# Altium schematic sheet [3] Motor Drives.SchDoc
size A4
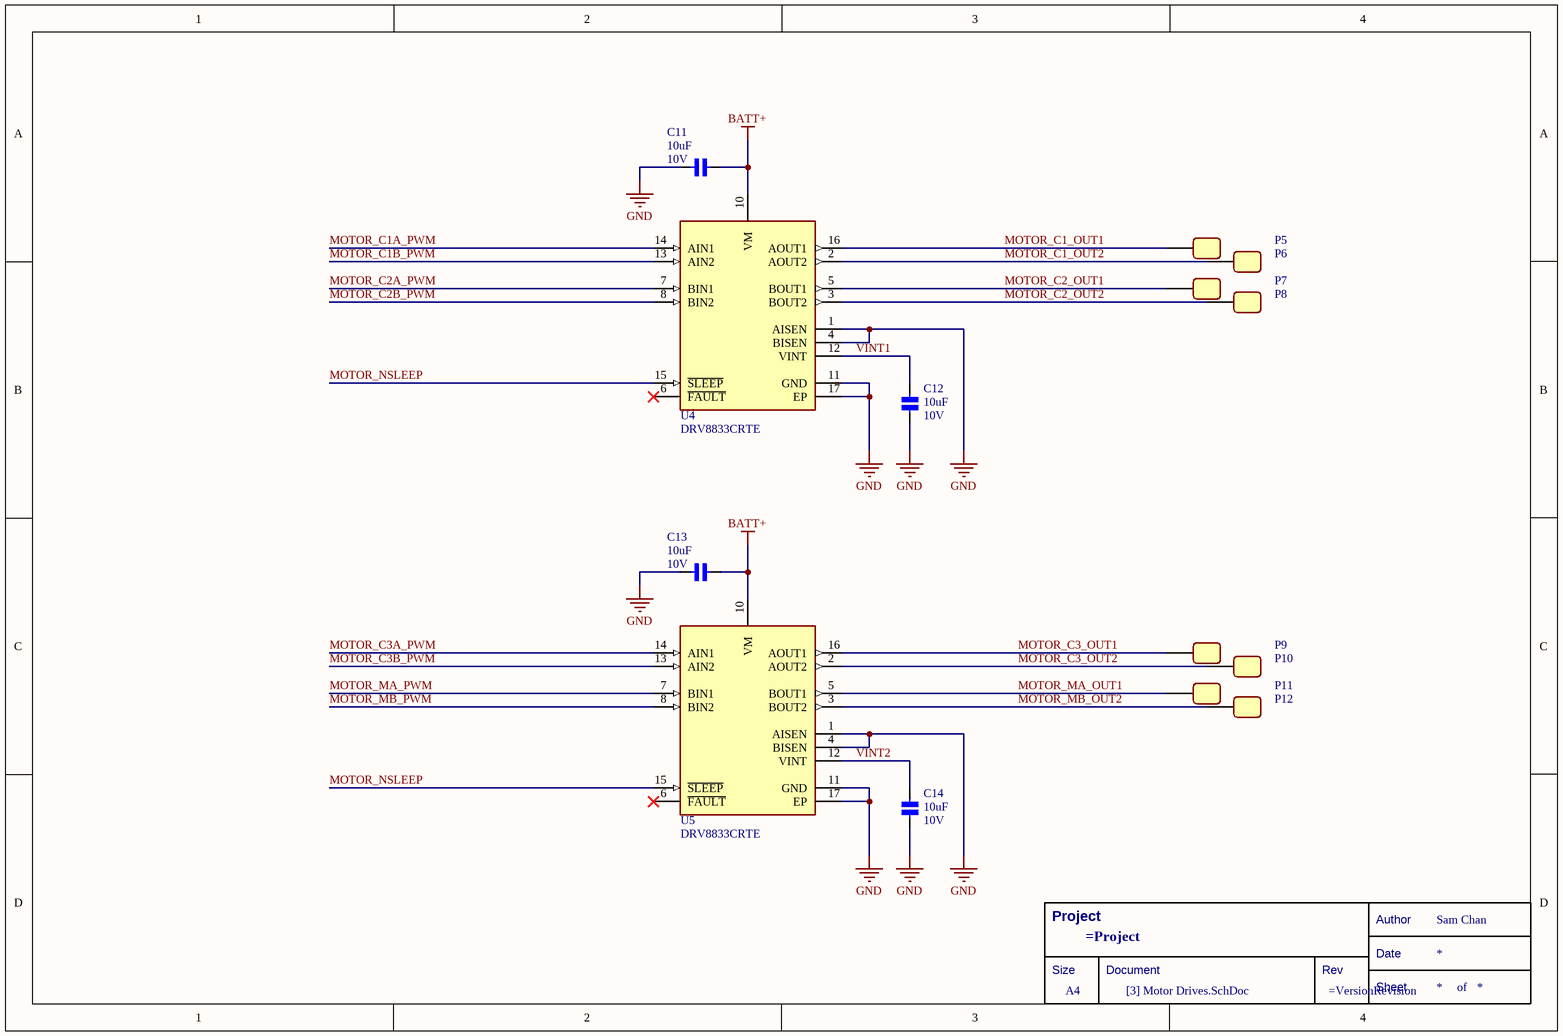
[diagram p0: [3] Motor Drives.SchDoc]

## Parts
*  Title Block  (value not drawn)  (graphical)
C11  Voltage - Rated: 10V  [CAPC0402X05N]  (hidden comment: 10uF)
C12  Voltage - Rated: 10V  [CAPC0402X05N]  (hidden comment: 10uF)
C13  Voltage - Rated: 10V  [CAPC0402X05N]  (hidden comment: 10uF)
C14  Voltage - Rated: 10V  [CAPC0402X05N]  (hidden comment: 10uF)
P5  PAD_1  [PAD_1.0X1.5MM]  (value not drawn)  (no BOM)
P6  PAD_1  [PAD_1.0X1.5MM]  (value not drawn)  (no BOM)
P7  PAD_1  [PAD_1.0X1.5MM]  (value not drawn)  (no BOM)
P8  PAD_1  [PAD_1.0X1.5MM]  (value not drawn)  (no BOM)
P9  PAD_1  [PAD_1.0X1.5MM]  (value not drawn)  (no BOM)
P10  PAD_1  [PAD_1.0X1.5MM]  (value not drawn)  (no BOM)
P11  PAD_1  [PAD_1.0X1.5MM]  (value not drawn)  (no BOM)
P12  PAD_1  [PAD_1.0X1.5MM]  (value not drawn)  (no BOM)
U4  DRV8833CRTE  [DRV8833CRTER]
U5  DRV8833CRTE  [DRV8833CRTER]

## Nets
BATT+: C11.2 C13.2 U4.10(VM) U5.10(VM)
GND: C11.1 C12.2 C13.1 C14.2 U4.1(AISEN) U4.4(BISEN) U4.11(GND) U4.17(EP) U5.1(AISEN) U5.4(BISEN) U5.11(GND) U5.17(EP)
MOTOR_C1_OUT1: P5.1 U4.16(AOUT1)
MOTOR_C1_OUT2: P6.1 U4.2(AOUT2)
MOTOR_C1A_PWM: U4.14(AIN1)
MOTOR_C1B_PWM: U4.13(AIN2)
MOTOR_C2_OUT1: P7.1 U4.5(BOUT1)
MOTOR_C2_OUT2: P8.1 U4.3(BOUT2)
MOTOR_C2A_PWM: U4.7(BIN1)
MOTOR_C2B_PWM: U4.8(BIN2)
MOTOR_C3_OUT1: P9.1 U5.16(AOUT1)
MOTOR_C3_OUT2: P10.1 U5.2(AOUT2)
MOTOR_C3A_PWM: U5.14(AIN1)
MOTOR_C3B_PWM: U5.13(AIN2)
MOTOR_MA_OUT1: P11.1 U5.5(BOUT1)
MOTOR_MA_PWM: U5.7(BIN1)
MOTOR_MB_OUT2: P12.1 U5.3(BOUT2)
MOTOR_MB_PWM: U5.8(BIN2)
MOTOR_NSLEEP: U4.15(~{SLEEP}) U5.15(~{SLEEP})
VINT1: C12.1 U4.12(VINT)
VINT2: C14.1 U5.12(VINT)

Not connected (* = marked no-connect by the designer): U4 6(~{FAULT})*; U5 6(~{FAULT})*

## Notes on the sheet
- (in symbol Title Block) Project; Author; Sam Chan; Date; Size; Document; Rev; A4; Sheet; of

## Library data of the parts
* = Title Block: Standard Title Block
C11-C14 = CER 10UF 10V: CAP CER 10UF 10V X5R 0402; Manufacturer: Murata Electronics; Manufacturer Part Number: GRM155R61A106ME44D; Category: Capacitors; Supplier 1: LCSC; Supplier Part Number 1: C77000; Package / Case: 0402; Capacitance: 10uF
P5-P12 = PAD_1: a Rec Pad, 1.0X1.5mm
U4 U5 = DRV8833CRTE: Bipolar Motor Driver Power MOSFET PWM 16-WQFN (3x3); Manufacturer: Texas Instruments; Categories: Motor Drivers, Controllers; Case: 16-WQFN Exposed Pad; Manufacturer Part Number: DRV8833CRTE; Supplier 1: LCSC; Supplier Part Number 1: C154936